# Altium project Power Distribution Board.PrjPcb (part 2 of 2)

## Sheet SH9 - RS-485.SchDoc: RS-485
size B; CheckedBy: Cindy Li; DrawnBy: Farris Matar; Engineer: Farris Matar; Organization: UW Robotics; Address1: 200 University Avenue; Address2: Waterloo; Address3: Ontario; Address4: Canada N2L 3G6; DocumentNumber: 9; Revision: 3; SheetNumber: 9; SheetTotal: 9
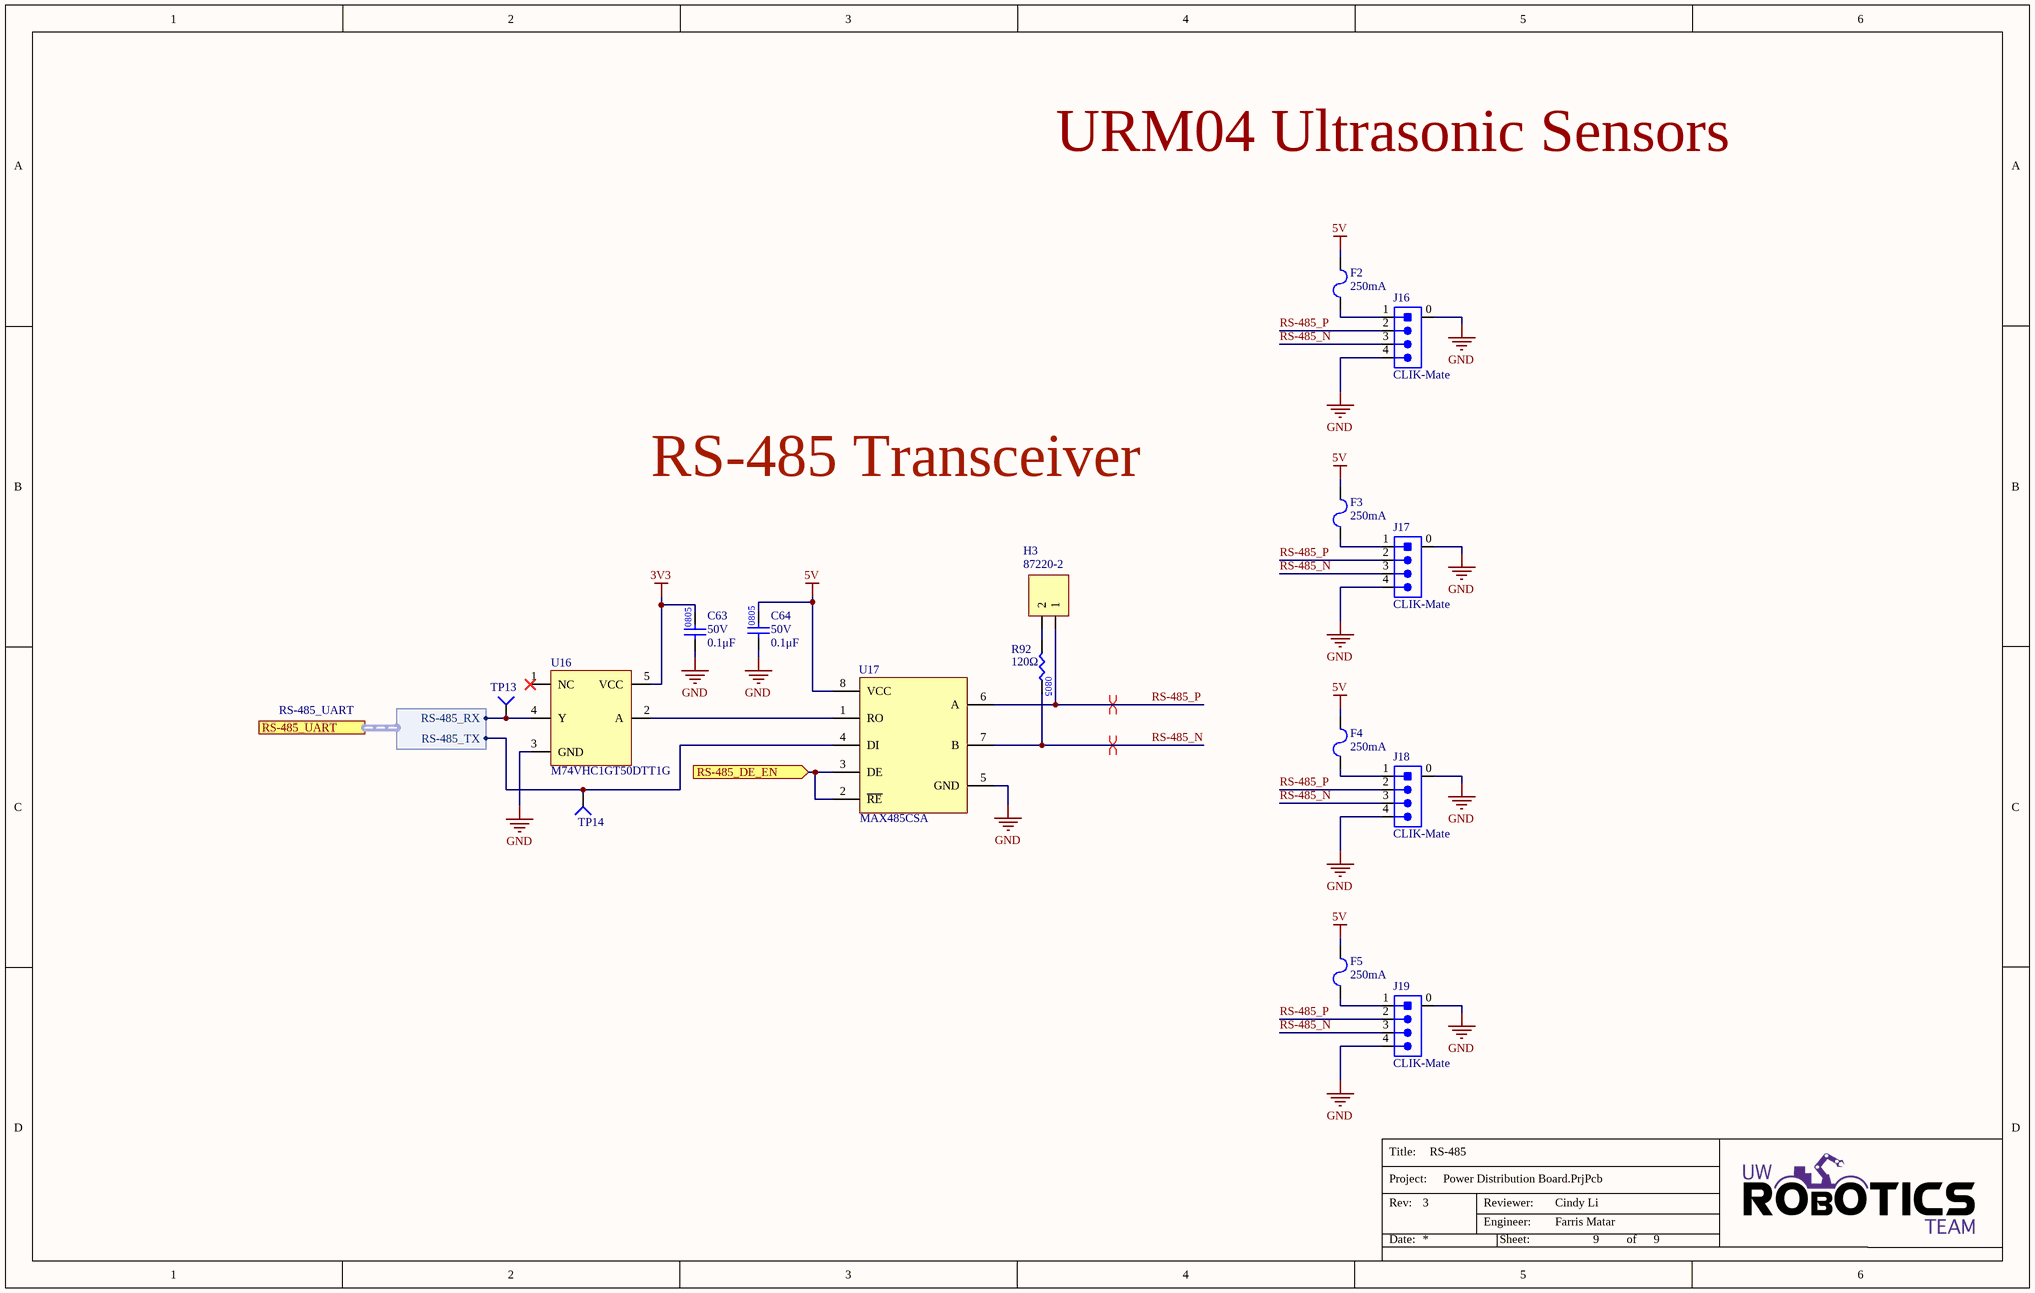
[diagram p8: SH9 - RS-485.SchDoc]

### Parts
C63  value 0.1μF  Voltage Rating: 50V  [CAP2012]  (hidden comment: CAP_0.1uF_50V_0805)
C64  value 0.1μF  Voltage Rating: 50V  [CAP2012]  (hidden comment: CAP_0.1uF_50V_0805)
F2  Current Rating: 250mA  [FUSE_1206]  (hidden comment: FUSE_250mA_1206)
F3  Current Rating: 250mA  [FUSE_1206]  (hidden comment: FUSE_250mA_1206)
F4  Current Rating: 250mA  [FUSE_1206]  (hidden comment: FUSE_250mA_1206)
F5  Current Rating: 250mA  [FUSE_1206]  (hidden comment: FUSE_250mA_1206)
H3  Manufacturer Part Number 1: 87220-2  [HDR1X2]  (hidden comment: JUMPER_2)
J16  Family: CLIK-Mate  [MOLEX-5025850470]  (hidden comment: CON_4M_SM_RA)
J17  Family: CLIK-Mate  [MOLEX-5025850470]  (hidden comment: CON_4M_SM_RA)
J18  Family: CLIK-Mate  [MOLEX-5025850470]  (hidden comment: CON_4M_SM_RA)
J19  Family: CLIK-Mate  [MOLEX-5025850470]  (hidden comment: CON_4M_SM_RA)
R92  value 120Ω  [RES0805]  (hidden comment: RES_120Ω_0805_1%)
TP13  TESTPOINT_1MM_CIRCLE  [TESTPOINT_CIRCLE_1MM]  (value not drawn)  (no BOM)
TP14  TESTPOINT_1MM_CIRCLE  [TESTPOINT_CIRCLE_1MM]  (value not drawn)  (no BOM)
U16  Manufacturer Part Number 1: M74VHC1GT50DTT1G  [SN74LV1T34DBVR]  (hidden comment: IC_BUFFER_TSOP5)
U17  MAX485CSA  [SOIC127P600X175-8N]

### Ports
RS-485_DE_EN (in), RS-485_UART (harness RS-485_UART)

### Harnesses
RS-485_UART: RS-485_RX, RS-485_TX

### Nets
3V3: C63.2 U16.5(VCC)
5V: C64.2 F2.2 F3.2 F4.2 F5.2 U17.8(VCC)
GND: C63.1 C64.1 J16.0 J16.4 J17.0 J17.4 J18.0 J18.4 J19.0 J19.4 U16.3(GND) U17.5(GND)  [project net AGND]
RS-485_N: J16.3 J17.3 J18.3 J19.3 R92.2 U17.7(B)
RS-485_P: H3.1 J16.2 J17.2 J18.2 J19.2 U17.6(A)
NetF2_1: F2.1 J16.1
NetF3_1: F3.1 J17.1
NetF4_1: F4.1 J18.1
NetF5_1: F5.1 J19.1
NetH3_2: H3.2 R92.1
NetTP13_1: TP13.1(=value) U16.4(Y) ; port RS-485_UART.RS-485_RX
NetTP14_1: TP14.1(=value) U17.4(DI) ; port RS-485_UART.RS-485_TX
NetU11_37: U17.2(~{RE}) U17.3(DE) ; port RS-485_DE_EN
NetU16_2: U16.2(A) U17.1(RO)

Not connected (* = marked no-connect by the designer): U16 1(NC)*

### Layout directives
differential pair: RS-485_N, RS-485_P

### Notes on the sheet
- URM04 Ultrasonic Sensors
- RS-485 Transceiver
- Title:
- Project:
- Date:
- Rev:
- Reviewer:
- Engineer:
- Sheet:
- of

### Library data of the parts
C63 C64 = CAP_0.1uF_50V_0805: CAP CER 0.1UF 50V X7R 0805; Manufacturer Part Number 1: GCM21BR71H104KA37K; Manufacturer 1: Murata Electronics; Package/Footprint: 0805; Supplier Part Number 1: 490-8049-1-ND; Supplier 1: Digi-Key; Dielectric: X7R; LCSC Part #: C49678; Mounting Type: SMD
F2-F5 = FUSE_250mA_1206: FUSE BOARD MNT 250MA 125VAC/VDC; Manufacturer 1: Littelfuse; Manufacturer Part Number 1: 0466.250NR; Package/Footprint: 1206; Supplier 1: Digi-Key; Supplier Part Number 1: F1452CT-ND; Mounting Type: SMD
H3 = JUMPER_2: HEADER 2X1; Manufacturer 1: TE Connectivity; Package/Footprint: TH; Supplier 1: Digi-Key; Supplier Part Number 1: A26542-ND; Mount: Through Hole; Mounting Type: TH
J16-J19 = CON_4M_SM_RA: CONN HEADER SMD RIGHT ANGLE 1.5 MM PITCH; Supplier 1: Digi-Key; Supplier Part Number 1: WM9449CT-ND; Package/Footprint: SMD; Mounting Type: SMD
R92 = RES_120Ω_0805_1%: RES 120 OHM 1% 1/8W 0805; Manufacturer 1: Vishay; Manufacturer Part Number 1: CRCW0805120RFKEA; Package/Footprint: 0805; Supplier Part Number 1: 541-120CCT-ND; Supplier 1: Digi-Key; LCSC Part #: C17437; Mounting Type: SMD
TP13 TP14 = TESTPOINT_1MM_CIRCLE: TESTPOINT 1MM CIRCLE
U16 = IC_BUFFER_TSOP5: IC BUFFER NON-INVERT 5.5V 5TSOP; Manufacturer 1: onsemi; Package/Footprint: TSOP-5; Supplier 1: Digi-Key; Supplier Part Number 1: M74VHC1GT50DTT1GOSCT-ND; Mounting Type: SMD
U17 = MAX485CSA: IC RS485 TRANSCEIVER HALF 1/1 8SOIC; Manufacturer 1: Maxim Integrated; Manufacturer Part Number 1: MAX485CSA+T; Protocol: RS422, RS485; Data Rate: 2.5Mbps; Supply Voltage: 4.75V - 5.25V; Package/Footprint: 8-SOIC; Supplier 1: Digi-Key; Supplier Part Number 1: MAX485CSA+TCT-ND; Mounting Type: SMD; LCSC Part #: C9945

## Sheet SH10 - BMS.SchDoc: BMS
size 279 x 215 mm
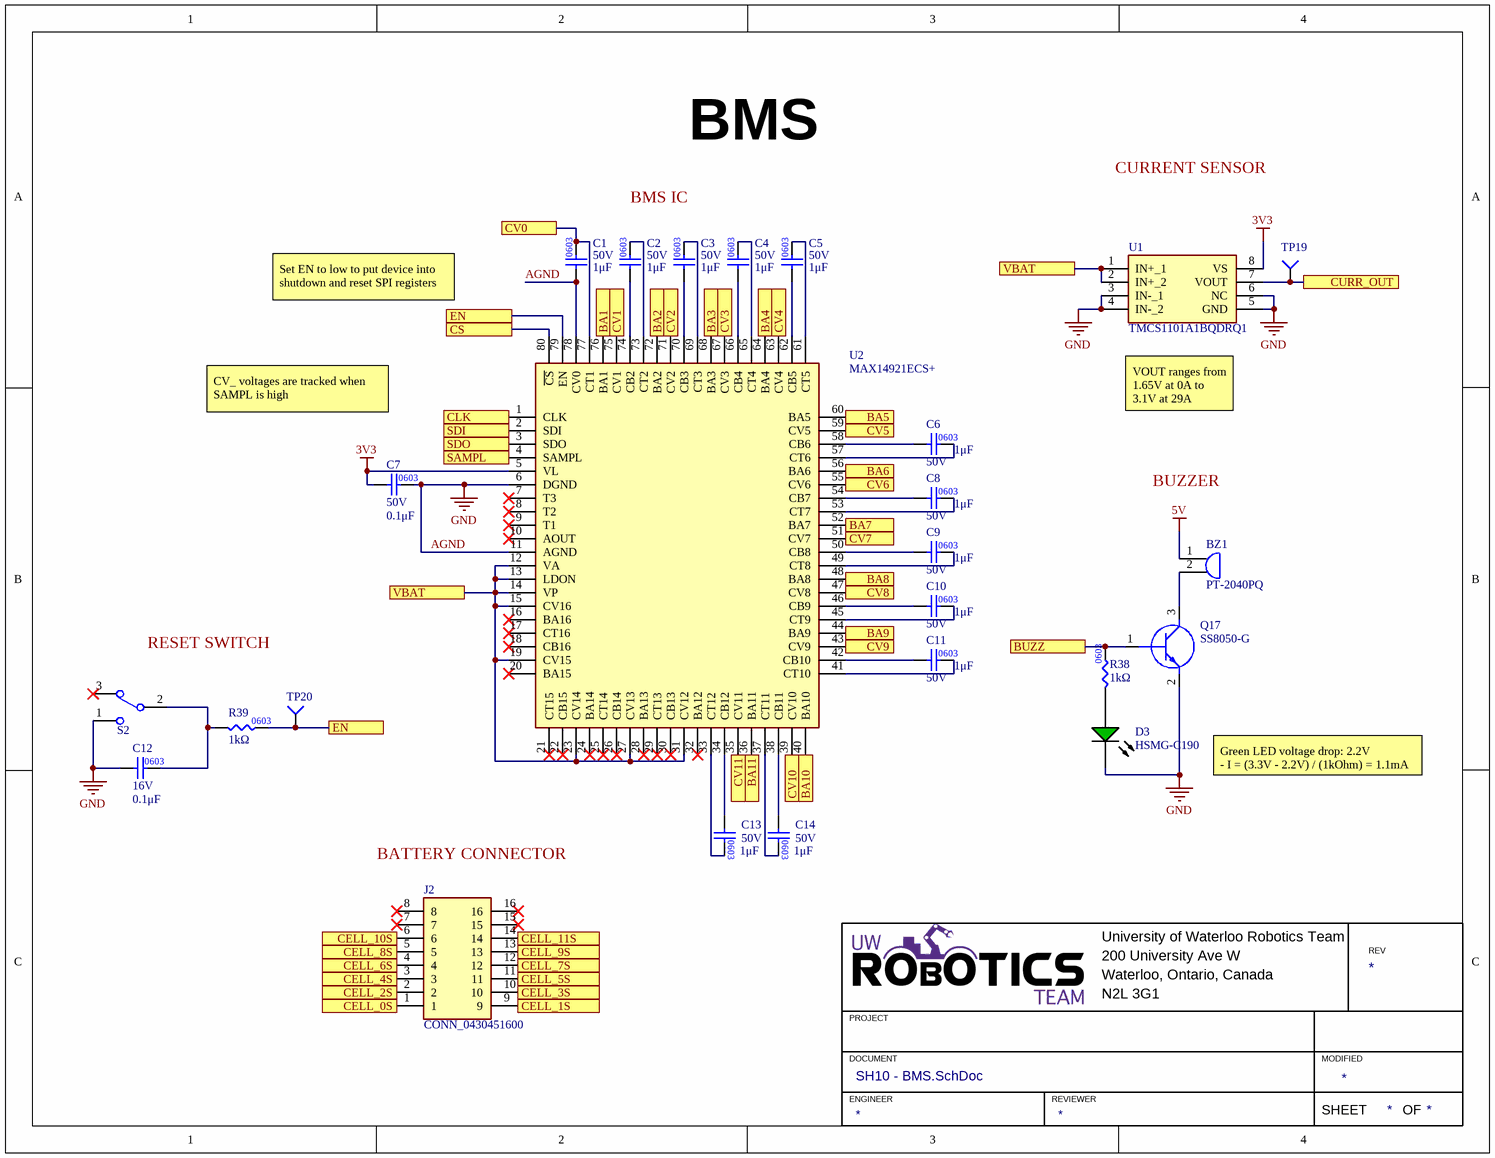
[diagram p9: SH10 - BMS.SchDoc]

### Parts
BZ1  PT-2040PQ  [PT2040PQ]
C1  value 1μF  Voltage Rating: 50V  [CAP0603]  (hidden comment: CAP_1uF_50V_0603)
C2  value 1μF  Voltage Rating: 50V  [CAP0603]  (hidden comment: CAP_1uF_50V_0603)
C3  value 1μF  Voltage Rating: 50V  [CAP0603]  (hidden comment: CAP_1uF_50V_0603)
C4  value 1μF  Voltage Rating: 50V  [CAP0603]  (hidden comment: CAP_1uF_50V_0603)
C5  value 1μF  Voltage Rating: 50V  [CAP0603]  (hidden comment: CAP_1uF_50V_0603)
C6  value 1μF  Voltage Rating: 50V  [CAP0603]  (hidden comment: CAP_1uF_50V_0603)
C7  value 0.1μF  Voltage Rating: 50V  [CAP0603]  (hidden comment: CAP_0.1uF_50V_0603)
C8  value 1μF  Voltage Rating: 50V  [CAP0603]  (hidden comment: CAP_1uF_50V_0603)
C9  value 1μF  Voltage Rating: 50V  [CAP0603]  (hidden comment: CAP_1uF_50V_0603)
C10  value 1μF  Voltage Rating: 50V  [CAP0603]  (hidden comment: CAP_1uF_50V_0603)
C11  value 1μF  Voltage Rating: 50V  [CAP0603]  (hidden comment: CAP_1uF_50V_0603)
C12  value 0.1μF  Voltage Rating: 16V  [CAP0603]  (hidden comment: CAP_0.1uF_16V_0603)
C13  value 1μF  Voltage Rating: 50V  [CAP0603]  (hidden comment: CAP_1uF_50V_0603)
C14  value 1μF  Voltage Rating: 50V  [CAP0603]  (hidden comment: CAP_1uF_50V_0603)
D3  HSMG-C190  [AVAG-HSMX-C190_V]
J2  CONN_0430451600  [0430451600]
Q17  Manufacturer_Part_Number: SS8050-G  [SOT23-3]  (hidden comment: NPN_40V_1.5A)
R38  value 1kΩ  [RES0603]  (hidden comment: RES_1kΩ_0603_5%)
R39  value 1kΩ  [RES0603]  (hidden comment: RES_1kΩ_0603_5%)
S2  SW_TOGGLE_SPDT  [100SP1T1B4M2QE]  (value not drawn)
TP19  TESTPOINT_1MM_SQUARE  [TESTPOINT_SQUARE_1MM]  (value not drawn)  (no BOM)
TP20  TESTPOINT_1MM_SQUARE  [TESTPOINT_SQUARE_1MM]  (value not drawn)  (no BOM)
U1  TMCS1101A1BQDRQ1  [SOIC127P600X175-8N]
U2  MAX14921ECS+  [QFP50P1400X1400X120-80N]

### Ports
BA1, BA2, BA3, BA4, BA5, BA6, BA7, BA8, BA9, BA10, BA11, BUZZ, CELL_0S, CELL_1S, CELL_2S, CELL_3S, CELL_4S, CELL_5S, CELL_6S, CELL_7S, CELL_8S, CELL_9S, CELL_10S, CELL_11S, CLK, CS, CURR_OUT, CV0, CV1, CV2, CV3, CV4, CV5, CV6, CV7, CV8, CV9, CV10, CV11, EN, SAMPL, SDI, SDO, VBAT

### Nets
3V3: C7.1 U1.8(VS) U2.5(VL)
5V: BZ1.1
AGND: C1.1 C1.2 C7.2 C12.1 D3.2(K) J2.1 Q17.2(E) S2.1 U1.3(IN-_1) U1.4(IN-_2) U1.5(GND) U1.6(NC) U2.6(DGND) U2.11(AGND) U2.77(CT1) U2.78(CV0) ; port CELL_0S, port CV0  [also labelled GND]
NetBZ1_2: BZ1.2 Q17.3(C)
NetC2_1: C2.1 U2.74(CB2)
NetC2_2: C2.2 U2.73(CT2)
NetC3_1: C3.1 U2.70(CB3)
NetC3_2: C3.2 U2.69(CT3)
NetC4_1: C4.1 U2.66(CB4)
NetC4_2: C4.2 U2.65(CT4)
NetC5_1: C5.1 U2.62(CB5)
NetC5_2: C5.2 U2.61(CT5)
NetC6_1: C6.1 U2.58(CB6)
NetC6_2: C6.2 U2.57(CT6)
NetC8_1: C8.1 U2.54(CB7)
NetC8_2: C8.2 U2.53(CT7)
NetC9_1: C9.1 U2.50(CB8)
NetC9_2: C9.2 U2.49(CT8)
NetC10_1: C10.1 U2.46(CB9)
NetC10_2: C10.2 U2.45(CT9)
NetC11_1: C11.1 U2.42(CB10)
NetC11_2: C11.2 U2.41(CT10)
NetC12_2: C12.2 R39.1 S2.2
NetC13_1: C13.1 U2.34(CB12)
NetC13_2: C13.2 U2.33(CT12)
NetC14_1: C14.1 U2.38(CB11)
NetC14_2: C14.2 U2.37(CT11)
NetD3_1: D3.1(A) R38.1
NetJ2_2: J2.2 ; port CELL_2S
NetJ2_3: J2.3 ; port CELL_4S
NetJ2_4: J2.4 ; port CELL_6S
NetJ2_5: J2.5 ; port CELL_8S
NetJ2_6: J2.6 ; port CELL_10S
NetJ2_9: J2.9 ; port CELL_1S
NetJ2_10: J2.10 ; port CELL_3S
NetJ2_11: J2.11 ; port CELL_5S
NetJ2_12: J2.12 ; port CELL_7S
NetJ2_13: J2.13 ; port CELL_9S
NetJ2_14: J2.14 ; port CELL_11S
NetQ4_1: U2.60(BA5) ; port BA5
NetQ5_1: U2.36(BA11) ; port BA11
NetQ6_1: U2.40(BA10) ; port BA10
NetQ9_1: U2.64(BA4) ; port BA4
NetQ10_1: U2.44(BA9) ; port BA9
NetQ11_1: U2.68(BA3) ; port BA3
NetQ12_1: U2.48(BA8) ; port BA8
NetQ13_1: U2.72(BA2) ; port BA2
NetQ14_1: U2.52(BA7) ; port BA7
NetQ15_1: U2.76(BA1) ; port BA1
NetQ16_1: U2.56(BA6) ; port BA6
NetQ17_1: Q17.1(B) R38.2 ; port BUZZ
NetR2_2: U2.59(CV5) ; port CV5
NetR3_2: U2.35(CV11) ; port CV11
NetR6_2: U2.39(CV10) ; port CV10
NetR7_2: U2.63(CV4) ; port CV4
NetR10_2: U2.43(CV9) ; port CV9
NetR11_2: U2.67(CV3) ; port CV3
NetR20_2: U2.47(CV8) ; port CV8
NetR24_2: U2.71(CV2) ; port CV2
NetR28_2: U2.51(CV7) ; port CV7
NetR32_2: U2.75(CV1) ; port CV1
NetR36_2: U2.55(CV6) ; port CV6
NetR39_2: R39.2 TP20.1(=value) U2.79(EN) ; port EN
NetTP19_1: TP19.1(=value) U1.7(VOUT) ; port CURR_OUT
NetU1_1: U1.1(IN+_1) U1.2(IN+_2) U2.12(VA) U2.13(LDON) U2.14(VP) U2.15(CV16) U2.19(CV15) U2.23(CV14) U2.27(CV13) U2.31(CV12) ; port VBAT
NetU2_1: U2.1(CLK) ; port CLK
NetU2_2: U2.2(SDI) ; port SDI
NetU2_3: U2.3(SDO) ; port SDO
NetU2_4: U2.4(SAMPL) ; port SAMPL
NetU2_80: U2.80(~{CS}) ; port CS

Not connected (* = marked no-connect by the designer): J2 7* 8* 15* 16*; S2 3*; U2 7(T3)* 8(T2)* 9(T1)* 10(AOUT)* 16(BA16)* 17(CT16)* 18(CB16)* 20(BA15)* 21(CT15)* 22(CB15)* 24(BA14)* 25(CT14)* 26(CB14)* 28(BA13)* 29(CT13)* 30(CB13)* 32(BA12)*

### Notes on the sheet
- BMS IC
- CURRENT SENSOR
- Set EN to low to put device into shutdown and reset SPI registers
- CV_ voltages are tracked when SAMPL is high
- (near U1) VOUT ranges from 1.65V at 0A to 3.1V at 29A
- BUZZER
- (near S2) RESET SWITCH
- Green LED voltage drop: 2.2V
  - I = (3.3V - 2.2V) / (1kOhm) = 1.1mA
- (near J2) BATTERY CONNECTOR
- University of Waterloo Robotics Team
- 200 University Ave W
- REV
- PROJECT
- Waterloo, Ontario, Canada
- N2L 3G1
- DOCUMENT
- ENGINEER
- REVIEWER
- MODIFIED
- SHEET
- OF
- (in symbol CAP_1uF_50V_0603) 0603

### Library data of the parts
BZ1 = PT-2040PQ: Loudspeaker or Buzzer; Manufacturer_Name: Mallory Sonalert; Datasheet Link: https://datasheet.datasheetarchive.com/originals/distributors/SFDatasheet-1/sf-00027599.pdf; Height: 9.4mm; Manufacturer_Part_Number: PT-2040PQ; Mouser Part Number: 539-PT2040PQ; Mouser Price/Stock: https://www.mouser.co.uk/ProductDetail/Mallory-Sonalert/PT-2040PQ?qs=l%2Fkuw%2F8%252BD9j2AVf7eGaf%252BA%3D%3D
C1-C6 C8-C11 C13 C14 = CAP_1uF_50V_0603: CAP CER 1UF 50V X6S 0603; Manufacturer Part Number 1: C1608X6S1H105K080AC; Manufacturer 1: TDK Corporation; Supplier Part Number 1: 445-7424-1-ND; Supplier 1: Digi-Key; Dielectric: X6S
C7 = CAP_0.1uF_50V_0603: CAP CER 0.1UF 50V X7R 0603; Manufacturer Part Number 1: CC0603KRX7R9BB104; Manufacturer 1: Yageo; Package/Footprint: 0603; Supplier Part Number 1: 311-1344-1-ND; Supplier 1: Digi-Key; Mounting Type: SMD; Dielectric: X7R
C12 = CAP_0.1uF_16V_0603: CAP CER 0.1UF 16V X7R 0603; Manufacturer Part Number 1: CC0603KRX7R7BB104; Manufacturer 1: Yageo; Package/Footprint: 0603; Supplier Part Number 1: 311-1088-1-ND; Supplier 1: Digi-Key; Dielectric: X7R; LCSC Number: C108079
D3 = CMP-1744-00002-1: Chip LED, Green, 2.2 V, -40 to 85 degC, 2-Pin SMD, RoHS, Tape and Reel; Frequency: 400 KHz; Max Supply Voltage: 5.5 V; Access Time: 3500 ns; Clock Frequency: 100 KHz; Case\Package: SOIC; Density: 32 kb; Nominal Supply Current: 2 mA; Interface: Serial; Min Supply Voltage: 1.7 V; Packaging: Tape and Reel; PackageReference: HSMX-C190; ComponentLink2URL: http://docs.avagotech.com/docs/AV02-0551EN; RoHSCompliant: true; Pins: 8; REACH SVHC: No SVHC; Max Operating Temperature: 85 degC; Width: 4 mm; Radiation Hardening: No; Package Quantity: 3000; ComponentLink3Description: Package Specification; ComponentLink1Description: Manufacturer URL; Min Operating Temperature: -40 degC; PackageDescription: 2-Pin Surface Mount Device, Body 1.6 x 0.8 mm, Height 0.9 mm; Max Clock Frequency: 100 KHz; Height: 1.5 mm; ComponentLink1URL: http://www.avagotech.com/; DatasheetVersion: Mar-12; ComponentLink2Description: Datasheet; Mount: Surface Mount; Length: 5 mm; ComponentLink3URL: http://www.fairchildsemi.com/dwg/MA/MA03D.pdf; LCSC Number: C188729
J2 = CONN_0430451600: Connector 16 Pin AJX; Manufacturer_Name: Molex; Datasheet Link: https://www.molex.com/pdm_docs/sd/430451600_sd.pdf; Height: 9.02mm; Manufacturer_Part_Number: 0430451600; Arrow Part Number: 0430451600; Arrow Price/Stock: https://www.arrow.com/en/products/0430451600/molex
Q17 = NPN_40V_1.5A: TRANS NPN 40V 1.5A SOT23; Manufacturer_Name: Comchip Technology; Datasheet Link: https://datasheet.datasheetarchive.com/originals/distributors/DKDS-12/229454.pdf; Height: 1.15mm; Mouser Part Number: 750-SS8050-G; Mouser Price/Stock: https://www.mouser.co.uk/ProductDetail/Comchip-Technology/SS8050-G?qs=LLUE9lz1YbcHg%252BWLMAtcrQ%3D%3D; Arrow Part Number: SS8050-G; Arrow Price/Stock: https://www.arrow.com/en/products/ss8050-g/comchip-technology?region=nac
R38 R39 = RES_1kΩ_0603_5%: RES 1K OHM 5% 1/10W 0603; Manufacturer 1: Yageo; Manufacturer Part Number 1: RC0603JR-071KL; Package/Footprint: 0603; Supplier Part Number 1: 311-1.0KGRCT-ND; Supplier 1: Digi-Key; Mounting Type: SMD; LCSC Number: C14676
S2 = SW_TOGGLE_SPDT: SWITCH TOGGLE SPDT 5A 120V; Manufacturer 1: E-Switch; Voltage Rating (DC): 28V; Package/Footprint: TH; Supplier 1: Digi-Key; Mounting Type: TH; Throw Configuration: SPDT; Supplier Part Number 1: EG2355-ND; Manufacturer Part Number 1: 100SP1T1B4M2QE
TP19 = TESTPOINT_1MM_SQUARE: CURR_OUT
TP20 = TESTPOINT_1MM_SQUARE: TESTPOINT 1MM SQUARE
U1 = TMCS1101A1BQDRQ1: Hall-Effect Current Sensor; Manufacturer_Name: Texas Instruments; Datasheet Link: https://www.ti.com/lit/ds/symlink/tmcs1101-q1.pdf?HQS=dis-dk-null-digikeymode-dsf-pf-null-wwe&ts=1636812075055&ref_url=https%253A%252F%252Fwww.digikey.be%252F; Height: 1.75mm; Manufacturer_Part_Number: TMCS1101A1BQDRQ1; Mouser Part Number: 595-TMCS1101A3BQDRQ1; Mouser Price/Stock: https://www.mouser.co.uk/ProductDetail/Texas-Instruments/TMCS1101A3BQDRQ1?qs=QNEnbhJQKvb740%252BlrUS3Og%3D%3D; Arrow Part Number: TMCS1101A3BQDRQ1; Arrow Price/Stock: https://www.arrow.com/en/products/tmcs1101a3bqdrq1/texas-instruments?region=nac
U2 = MAX14921ECS+: IC 16s BMS; Manufacturer_Name: Maxim Integrated; Datasheet Link: http://pdfserv.maximintegrated.com/package_dwgs/21-0072.PDF; Height: 1.2mm; Manufacturer_Part_Number: MAX14921ECS+; Mouser Part Number: 700-MAX14921ECS+; Mouser Price/Stock: https://www.mouser.co.uk/ProductDetail/Maxim-Integrated/MAX14921ECS%2b?qs=Vwh6e7toGLhlnKi5DjCusg%3D%3D

## Sheet SH11 - Battery Balancing.SchDoc: Active Cell Balancing Circuit
size 279 x 215 mm
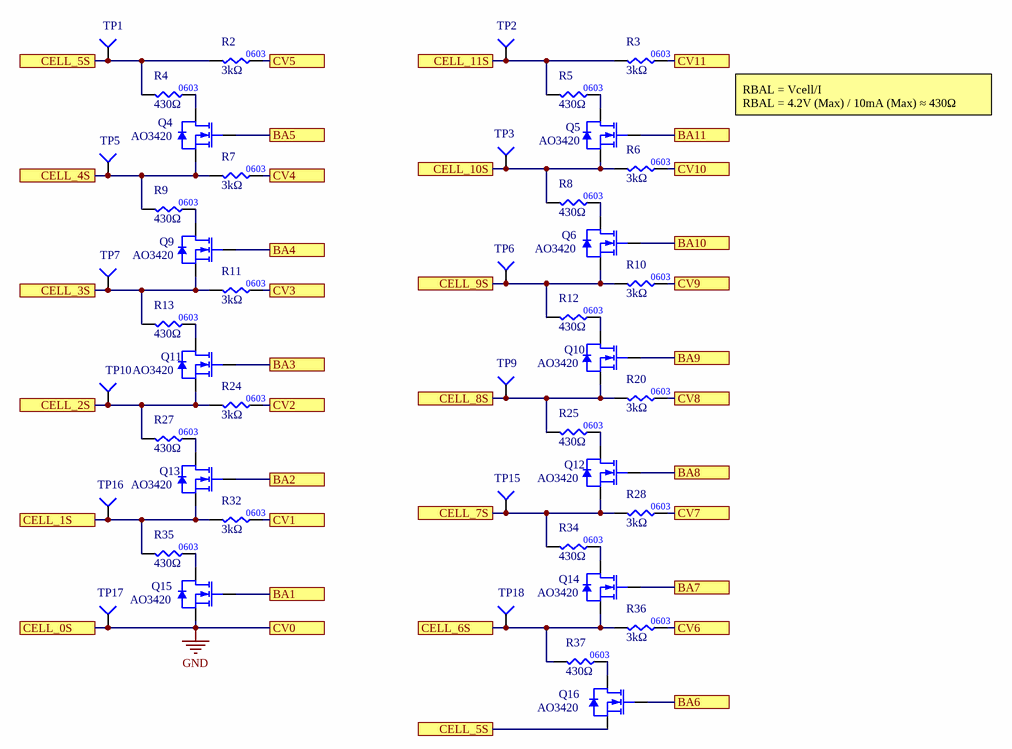
[diagram p10: SH11 - Battery Balancing.SchDoc]

### Parts
Q4  Manufacturer Part Number 1: AO3420  [SOT23-3]  (hidden comment: NMOS_20V_6A)
Q5  Manufacturer Part Number 1: AO3420  [SOT23-3]  (hidden comment: NMOS_20V_6A)
Q6  Manufacturer Part Number 1: AO3420  [SOT23-3]  (hidden comment: NMOS_20V_6A)
Q9  Manufacturer Part Number 1: AO3420  [SOT23-3]  (hidden comment: NMOS_20V_6A)
Q10  Manufacturer Part Number 1: AO3420  [SOT23-3]  (hidden comment: NMOS_20V_6A)
Q11  Manufacturer Part Number 1: AO3420  [SOT23-3]  (hidden comment: NMOS_20V_6A)
Q12  Manufacturer Part Number 1: AO3420  [SOT23-3]  (hidden comment: NMOS_20V_6A)
Q13  Manufacturer Part Number 1: AO3420  [SOT23-3]  (hidden comment: NMOS_20V_6A)
Q14  Manufacturer Part Number 1: AO3420  [SOT23-3]  (hidden comment: NMOS_20V_6A)
Q15  Manufacturer Part Number 1: AO3420  [SOT23-3]  (hidden comment: NMOS_20V_6A)
Q16  Manufacturer Part Number 1: AO3420  [SOT23-3]  (hidden comment: NMOS_20V_6A)
R2  value 3kΩ  [RES0603]  (hidden comment: RES_3kΩ_0603_1%)
R3  value 3kΩ  [RES0603]  (hidden comment: RES_3kΩ_0603_1%)
R4  value 430Ω  [RES0603]  (hidden comment: RES_430Ω_0603_5%)
R5  value 430Ω  [RES0603]  (hidden comment: RES_430Ω_0603_5%)
R6  value 3kΩ  [RES0603]  (hidden comment: RES_3kΩ_0603_1%)
R7  value 3kΩ  [RES0603]  (hidden comment: RES_3kΩ_0603_1%)
R8  value 430Ω  [RES0603]  (hidden comment: RES_430Ω_0603_5%)
R9  value 430Ω  [RES0603]  (hidden comment: RES_430Ω_0603_5%)
R10  value 3kΩ  [RES0603]  (hidden comment: RES_3kΩ_0603_1%)
R11  value 3kΩ  [RES0603]  (hidden comment: RES_3kΩ_0603_1%)
R12  value 430Ω  [RES0603]  (hidden comment: RES_430Ω_0603_5%)
R13  value 430Ω  [RES0603]  (hidden comment: RES_430Ω_0603_5%)
R20  value 3kΩ  [RES0603]  (hidden comment: RES_3kΩ_0603_1%)
R24  value 3kΩ  [RES0603]  (hidden comment: RES_3kΩ_0603_1%)
R25  value 430Ω  [RES0603]  (hidden comment: RES_430Ω_0603_5%)
R27  value 430Ω  [RES0603]  (hidden comment: RES_430Ω_0603_5%)
R28  value 3kΩ  [RES0603]  (hidden comment: RES_3kΩ_0603_1%)
R32  value 3kΩ  [RES0603]  (hidden comment: RES_3kΩ_0603_1%)
R34  value 430Ω  [RES0603]  (hidden comment: RES_430Ω_0603_5%)
R35  value 430Ω  [RES0603]  (hidden comment: RES_430Ω_0603_5%)
R36  value 3kΩ  [RES0603]  (hidden comment: RES_3kΩ_0603_1%)
R37  value 430Ω  [RES0603]  (hidden comment: RES_430Ω_0603_5%)
TP1  TESTPOINT_1MM_SQUARE  [TESTPOINT_SQUARE_1MM]  (value not drawn)  (no BOM)
TP2  TESTPOINT_1MM_SQUARE  [TESTPOINT_SQUARE_1MM]  (value not drawn)  (no BOM)
TP3  TESTPOINT_1MM_SQUARE  [TESTPOINT_SQUARE_1MM]  (value not drawn)  (no BOM)
TP5  TESTPOINT_1MM_SQUARE  [TESTPOINT_SQUARE_1MM]  (value not drawn)  (no BOM)
TP6  TESTPOINT_1MM_SQUARE  [TESTPOINT_SQUARE_1MM]  (value not drawn)  (no BOM)
TP7  TESTPOINT_1MM_SQUARE  [TESTPOINT_SQUARE_1MM]  (value not drawn)  (no BOM)
TP9  TESTPOINT_1MM_SQUARE  [TESTPOINT_SQUARE_1MM]  (value not drawn)  (no BOM)
TP10  TESTPOINT_1MM_SQUARE  [TESTPOINT_SQUARE_1MM]  (value not drawn)  (no BOM)
TP15  TESTPOINT_1MM_SQUARE  [TESTPOINT_SQUARE_1MM]  (value not drawn)  (no BOM)
TP16  TESTPOINT_1MM_SQUARE  [TESTPOINT_SQUARE_1MM]  (value not drawn)  (no BOM)
TP17  TESTPOINT_1MM_SQUARE  [TESTPOINT_SQUARE_1MM]  (value not drawn)  (no BOM)
TP18  TESTPOINT_1MM_SQUARE  [TESTPOINT_SQUARE_1MM]  (value not drawn)  (no BOM)

### Ports
BA1, BA2, BA3, BA4, BA5, BA6, BA7, BA8, BA9, BA10, BA11, CELL_0S, CELL_1S, CELL_2S, CELL_3S, CELL_4S, CELL_5S, CELL_6S, CELL_7S, CELL_8S, CELL_9S, CELL_10S, CELL_11S, CV0, CV1, CV2, CV3, CV4, CV5, CV6, CV7, CV8, CV9, CV10, CV11

### Nets
GND: Q15.2(SOURCE) TP17.1(=value) ; port CELL_0S, port CV0  [project net AGND]
NetJ2_2: Q11.2(SOURCE) R24.1 R27.1 TP10.1(=value) ; port CELL_2S
NetJ2_3: Q4.2(SOURCE) R7.1 R9.1 TP5.1(=value) ; port CELL_4S
NetJ2_4: Q14.2(SOURCE) R36.1 R37.1 TP18.1(=value) ; port CELL_6S
NetJ2_5: Q10.2(SOURCE) R20.1 R25.1 TP9.1(=value) ; port CELL_8S
NetJ2_6: Q5.2(SOURCE) R6.1 R8.1 TP3.1(=value) ; port CELL_10S
NetJ2_9: Q13.2(SOURCE) R32.1 R35.1 TP16.1(=value) ; port CELL_1S
NetJ2_10: Q9.2(SOURCE) R11.1 R13.1 TP7.1(=value) ; port CELL_3S
NetJ2_11: Q16.2(SOURCE) R2.1 R4.1 TP1.1(=value) ; port CELL_5S
NetJ2_12: Q12.2(SOURCE) R28.1 R34.1 TP15.1(=value) ; port CELL_7S
NetJ2_13: Q6.2(SOURCE) R10.1 R12.1 TP6.1(=value) ; port CELL_9S
NetJ2_14: R3.1 R5.1 TP2.1(=value) ; port CELL_11S
NetQ4_1: Q4.1(GATE) ; port BA5
NetQ4_3: Q4.3(DRAIN) R4.2
NetQ5_1: Q5.1(GATE) ; port BA11
NetQ5_3: Q5.3(DRAIN) R5.2
NetQ6_1: Q6.1(GATE) ; port BA10
NetQ6_3: Q6.3(DRAIN) R8.2
NetQ9_1: Q9.1(GATE) ; port BA4
NetQ9_3: Q9.3(DRAIN) R9.2
NetQ10_1: Q10.1(GATE) ; port BA9
NetQ10_3: Q10.3(DRAIN) R12.2
NetQ11_1: Q11.1(GATE) ; port BA3
NetQ11_3: Q11.3(DRAIN) R13.2
NetQ12_1: Q12.1(GATE) ; port BA8
NetQ12_3: Q12.3(DRAIN) R25.2
NetQ13_1: Q13.1(GATE) ; port BA2
NetQ13_3: Q13.3(DRAIN) R27.2
NetQ14_1: Q14.1(GATE) ; port BA7
NetQ14_3: Q14.3(DRAIN) R34.2
NetQ15_1: Q15.1(GATE) ; port BA1
NetQ15_3: Q15.3(DRAIN) R35.2
NetQ16_1: Q16.1(GATE) ; port BA6
NetQ16_3: Q16.3(DRAIN) R37.2
NetR2_2: R2.2 ; port CV5
NetR3_2: R3.2 ; port CV11
NetR6_2: R6.2 ; port CV10
NetR7_2: R7.2 ; port CV4
NetR10_2: R10.2 ; port CV9
NetR11_2: R11.2 ; port CV3
NetR20_2: R20.2 ; port CV8
NetR24_2: R24.2 ; port CV2
NetR28_2: R28.2 ; port CV7
NetR32_2: R32.2 ; port CV1
NetR36_2: R36.2 ; port CV6

### Notes on the sheet
- RBAL = Vcell/I
  RBAL = 4.2V (Max) / 10mA (Max) ≈ 430Ω
- University of Waterloo Robotics Team
- 200 University Ave W
- REV
- PROJECT
- Waterloo, Ontario, Canada
- N2L 3G1
- DOCUMENT
- ENGINEER
- REVIEWER
- MODIFIED
- SHEET
- OF
- (in symbol RES_3kΩ_0603_1%) 0603

### Library data of the parts
Q4-Q6 Q9-Q16 = NMOS_20V_6A: MOSFET N-CH 20V 6A SOT-23; Manufacturer 1: Alpha & Omega; Supplier 1: Digi-Key; Supplier Part Number 1: 785-1014-2-ND
R2 R3 R6 R7 R10 R11 R20 R24 R28 R32 R36 = RES_3kΩ_0603_1%: RES 3K OHM 1% 1/10W 0603; Manufacturer 1: Yageo; Manufacturer Part Number 1: RC0603FR-073KL; Supplier 1: Digi-Key; Supplier Part Number 1: 311-3.00KHRCT-ND
R4 R5 R8 R9 R12 R13 R25 R27 R34 R35 R37 = RES_430Ω_0603_5%: RES 430 OHM 5% 1/10W 0603; Manufacturer 1: Stackpole Electronics; Manufacturer Part Number 1: RMCF0603JT430R; Package/Footprint: 0603; Supplier Part Number 1: RMCF0603JT430R; Supplier 1: Digi-Key; Mounting Type: SMD
TP1 = TESTPOINT_1MM_SQUARE: CELL5
TP2 = TESTPOINT_1MM_SQUARE: CELL11
TP3 = TESTPOINT_1MM_SQUARE: CELL10
TP5 = TESTPOINT_1MM_SQUARE: CELL4
TP6 = TESTPOINT_1MM_SQUARE: CELL9
TP7 = TESTPOINT_1MM_SQUARE: CELL3
TP9 = TESTPOINT_1MM_SQUARE: CELL8
TP10 = TESTPOINT_1MM_SQUARE: CELL2
TP15 = TESTPOINT_1MM_SQUARE: CELL7
TP16 = TESTPOINT_1MM_SQUARE: CELL1
TP17 = TESTPOINT_1MM_SQUARE: CELL0
TP18 = TESTPOINT_1MM_SQUARE: CELL6

## Nets that join several sheets
3V3: SH4 - 3.3V LINEAR REGULATOR (5 pins), SH5 - LOAD MONITORING 1 (R29.2 R30.2 R31.2 R33.2), SH7 - MICROCONTROLLER (22 pins), SH8 - CAN (C61.2 C62.2 U13.3 U14.3), SH9 - RS-485 (C63.2 U16.5), SH10 - BMS (C7.1 U1.8 U2.5)
5V: SH3 - 5V BUCK CONVERTER (9 pins), SH4 - 3.3V LINEAR REGULATOR (C45.2 U5.1 U5.3), SH5 - LOAD MONITORING 1 (12 pins), SH6 - LOAD MONITORING 2 (R85.2), SH7 - MICROCONTROLLER (J5.1), SH9 - RS-485 (6 pins), SH10 - BMS (BZ1.1)
5V_LOAD1: SH5 - LOAD MONITORING 1 (U6.5 U6.6 U6.7), SH6 - LOAD MONITORING 2 (J10.1)
5V_LOAD2: SH5 - LOAD MONITORING 1 (U7.5 U7.6 U7.7), SH6 - LOAD MONITORING 2 (J11.1)
5V_LOAD3: SH5 - LOAD MONITORING 1 (U8.5 U8.6 U8.7), SH6 - LOAD MONITORING 2 (J12.1)
5V_LOAD4: SH5 - LOAD MONITORING 1 (U10.5 U10.6 U10.7), SH6 - LOAD MONITORING 2 (J14.1)
17V: SH2 - 17V BUCK CONVERTER (9 pins), SH6 - LOAD MONITORING 2 (R84.2 U15.3)
AGND: SH1 - POWER (D1.1 D20.2 J1.1 R1.1), SH2 - 17V BUCK CONVERTER (15 pins), SH3 - 5V BUCK CONVERTER (29 pins), SH4 - 3.3V LINEAR REGULATOR (5 pins), SH5 - LOAD MONITORING 1 (12 pins), SH6 - LOAD MONITORING 2 (14 pins), SH7 - MICROCONTROLLER (33 pins), SH8 - CAN (12 pins), SH9 - RS-485 (12 pins), SH10 - BMS (16 pins), SH11 - Battery Balancing (Q15.2 TP17.1)
VBAT_FUSED: SH1 - POWER (F1.2 R93.2), SH2 - 17V BUCK CONVERTER (10 pins), SH3 - 5V BUCK CONVERTER (8 pins), SH6 - LOAD MONITORING 2 (J15.1 R87.2)
NetD16_1: SH6 - LOAD MONITORING 2 (D16.1 R85.1 R88.2), SH7 - MICROCONTROLLER (U11.20)
NetD17_1: SH6 - LOAD MONITORING 2 (D17.1 R84.1 R89.2), SH7 - MICROCONTROLLER (U11.21)
NetD19_1: SH6 - LOAD MONITORING 2 (D19.1 R87.1 R91.2), SH7 - MICROCONTROLLER (U11.27)
NetJ2_2: SH10 - BMS (J2.2), SH11 - Battery Balancing (Q11.2 R24.1 R27.1 TP10.1)
NetJ2_3: SH10 - BMS (J2.3), SH11 - Battery Balancing (Q4.2 R7.1 R9.1 TP5.1)
NetJ2_4: SH10 - BMS (J2.4), SH11 - Battery Balancing (Q14.2 R36.1 R37.1 TP18.1)
NetJ2_5: SH10 - BMS (J2.5), SH11 - Battery Balancing (Q10.2 R20.1 R25.1 TP9.1)
NetJ2_6: SH10 - BMS (J2.6), SH11 - Battery Balancing (Q5.2 R6.1 R8.1 TP3.1)
NetJ2_9: SH10 - BMS (J2.9), SH11 - Battery Balancing (Q13.2 R32.1 R35.1 TP16.1)
NetJ2_10: SH10 - BMS (J2.10), SH11 - Battery Balancing (Q9.2 R11.1 R13.1 TP7.1)
NetJ2_11: SH10 - BMS (J2.11), SH11 - Battery Balancing (Q16.2 R2.1 R4.1 TP1.1)
NetJ2_12: SH10 - BMS (J2.12), SH11 - Battery Balancing (Q12.2 R28.1 R34.1 TP15.1)
NetJ2_13: SH10 - BMS (J2.13), SH11 - Battery Balancing (Q6.2 R10.1 R12.1 TP6.1)
NetJ2_14: SH10 - BMS (J2.14), SH11 - Battery Balancing (R3.1 R5.1 TP2.1)
NetQ3_1: SH6 - LOAD MONITORING 2 (Q3.1), SH7 - MICROCONTROLLER (U11.24)
NetQ4_1: SH10 - BMS (U2.60), SH11 - Battery Balancing (Q4.1)
NetQ5_1: SH10 - BMS (U2.36), SH11 - Battery Balancing (Q5.1)
NetQ6_1: SH10 - BMS (U2.40), SH11 - Battery Balancing (Q6.1)
NetQ9_1: SH10 - BMS (U2.64), SH11 - Battery Balancing (Q9.1)
NetQ10_1: SH10 - BMS (U2.44), SH11 - Battery Balancing (Q10.1)
NetQ11_1: SH10 - BMS (U2.68), SH11 - Battery Balancing (Q11.1)
NetQ12_1: SH10 - BMS (U2.48), SH11 - Battery Balancing (Q12.1)
NetQ13_1: SH10 - BMS (U2.72), SH11 - Battery Balancing (Q13.1)
NetQ14_1: SH10 - BMS (U2.52), SH11 - Battery Balancing (Q14.1)
NetQ15_1: SH10 - BMS (U2.76), SH11 - Battery Balancing (Q15.1)
NetQ16_1: SH10 - BMS (U2.56), SH11 - Battery Balancing (Q16.1)
NetR2_2: SH10 - BMS (U2.59), SH11 - Battery Balancing (R2.2)
NetR3_2: SH10 - BMS (U2.35), SH11 - Battery Balancing (R3.2)
NetR6_2: SH10 - BMS (U2.39), SH11 - Battery Balancing (R6.2)
NetR7_2: SH10 - BMS (U2.63), SH11 - Battery Balancing (R7.2)
NetR10_2: SH10 - BMS (U2.43), SH11 - Battery Balancing (R10.2)
NetR11_2: SH10 - BMS (U2.67), SH11 - Battery Balancing (R11.2)
NetR20_2: SH10 - BMS (U2.47), SH11 - Battery Balancing (R20.2)
NetR24_2: SH10 - BMS (U2.71), SH11 - Battery Balancing (R24.2)
NetR28_2: SH10 - BMS (U2.51), SH11 - Battery Balancing (R28.2)
NetR29_1: SH5 - LOAD MONITORING 1 (R29.1 U6.8), SH7 - MICROCONTROLLER (U11.23)
NetR30_1: SH5 - LOAD MONITORING 1 (R30.1 U7.8), SH7 - MICROCONTROLLER (U11.11)
NetR31_1: SH5 - LOAD MONITORING 1 (R31.1 U8.8), SH7 - MICROCONTROLLER (U11.9)
NetR32_2: SH10 - BMS (U2.75), SH11 - Battery Balancing (R32.2)
NetR33_1: SH5 - LOAD MONITORING 1 (R33.1 U10.8), SH7 - MICROCONTROLLER (U11.3)
NetR36_2: SH10 - BMS (U2.55), SH11 - Battery Balancing (R36.2)
NetTP13_1: SH7 - MICROCONTROLLER (U11.52), SH9 - RS-485 (TP13.1 U16.4)
NetTP14_1: SH7 - MICROCONTROLLER (U11.51), SH9 - RS-485 (TP14.1 U17.4)
NetU6_4: SH5 - LOAD MONITORING 1 (U6.4), SH7 - MICROCONTROLLER (U11.22)
NetU7_4: SH5 - LOAD MONITORING 1 (U7.4), SH7 - MICROCONTROLLER (U11.10)
NetU8_4: SH5 - LOAD MONITORING 1 (U8.4), SH7 - MICROCONTROLLER (U11.8)
NetU10_4: SH5 - LOAD MONITORING 1 (U10.4), SH7 - MICROCONTROLLER (U11.2)
NetU11_33: SH7 - MICROCONTROLLER (U11.33), SH8 - CAN (U14.4)
NetU11_34: SH7 - MICROCONTROLLER (U11.34), SH8 - CAN (U14.1)
NetU11_37: SH7 - MICROCONTROLLER (U11.37), SH9 - RS-485 (U17.2 U17.3)
NetU11_44: SH7 - MICROCONTROLLER (U11.44), SH8 - CAN (U13.4)
NetU11_45: SH7 - MICROCONTROLLER (U11.45), SH8 - CAN (U13.1)

## Assembly variants
Only Populated Components: not fitted R28 R31 R44 R47 R60 R77